# EAGLE design ArduinoStandaloneUsbSwitch-4Port (EAGLE 7.4.0)
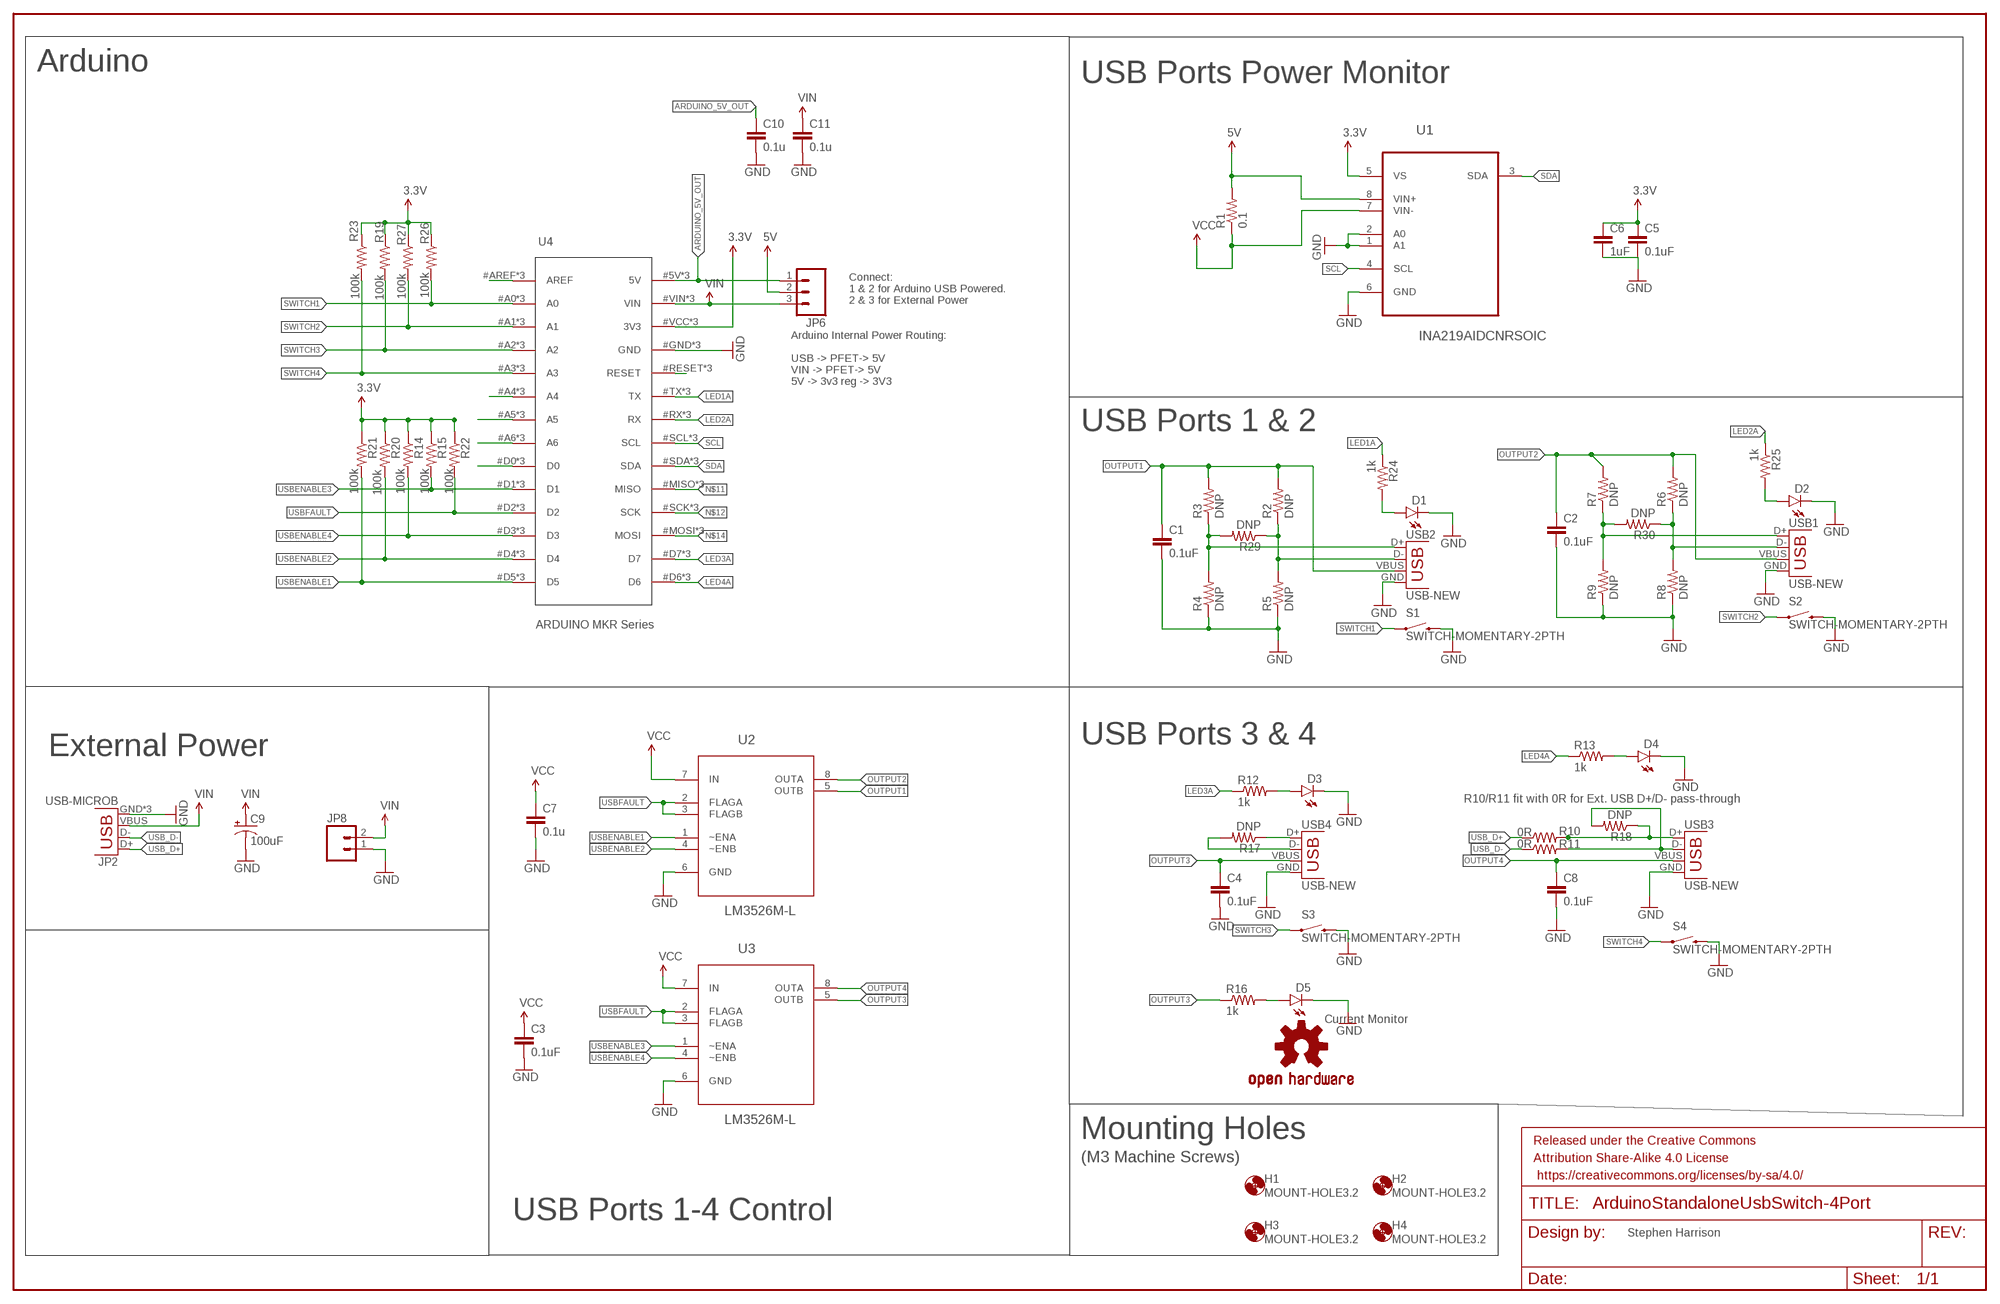
[diagram p0: schematic, sheet 1]

## Parts
C1  0.1uF  CAP0805  [0805]
C2  0.1uF  CAP0805  [0805]
C3  0.1uF  CAP0805  [0805]
C4  0.1uF  CAP0805  [0805]
C5  0.1uF  CAP0805  [0805]
C6  1uF  CAP0805  [0805]
C7  0.1u  CAP0805  [0805]
C8  0.1uF  CAP0805  [0805]
C9  100uF  100UF-10V-10%(TANT)  [EIA7343]
C10  0.1u  CAP0805  [0805]
C11  0.1u  CAP0805  [0805]
D1  LED3MM  [LED3MM]
D2  LED3MM  [LED3MM]
D3  LED3MM  [LED3MM]
D4  LED3MM  [LED3MM]
D5  LED1206-BOTTOM  [LED-1206-BOTTOM]
FRAME1  FRAME-LEDGER  [CREATIVE_COMMONS]
H1  MOUNT-HOLE3.2  [3,2]
H2  MOUNT-HOLE3.2  [3,2]
H3  MOUNT-HOLE3.2  [3,2]
H4  MOUNT-HOLE3.2  [3,2]
JP2  USB-MICROB  [USB-MICROB]
JP6  M03PTH  [1X03]
JP8  M025MM  [SCREWTERMINAL-5MM-2]
LOGO1  OSHW-LOGOL  [OSHW-LOGO-L]
R1  0.1  0.001OHM-3W-1%(2512)3W/1%  [2512]
R2  DNP  RESISTOR0805-RES  [0805]
R3  DNP  RESISTOR0805-RES  [0805]
R4  DNP  RESISTOR0805-RES  [0805]
R5  DNP  RESISTOR0805-RES  [0805]
R6  DNP  RESISTOR0805-RES  [0805]
R7  DNP  RESISTOR0805-RES  [0805]
R8  DNP  RESISTOR0805-RES  [0805]
R9  DNP  RESISTOR0805-RES  [0805]
R10  0R  RESISTOR0805-RES  [0805]
R11  0R  RESISTOR0805-RES  [0805]
R12  1k  RESISTOR0805-RES  [0805]
R13  1k  RESISTOR0805-RES  [0805]
R14  100k  RESISTOR0805-RES  [0805]
R15  100k  RESISTOR0805-RES  [0805]
R16  1k  RESISTOR0805-RES  [0805]
R17  DNP  RESISTOR0805-RES  [0805]
R18  DNP  RESISTOR0805-RES  [0805]
R19  100k  RESISTOR0805-RES  [0805]
R20  100k  RESISTOR0805-RES  [0805]
R21  100k  RESISTOR0805-RES  [0805]
R22  100k  RESISTOR0805-RES  [0805]
R23  100k  RESISTOR0805-RES  [0805]
R24  1k  RESISTOR0805-RES  [0805]
R25  1k  RESISTOR0805-RES  [0805]
R26  100k  RESISTOR0805-RES  [0805]
R27  100k  RESISTOR0805-RES  [0805]
R29  DNP  RESISTOR0805-RES  [0805]
R30  DNP  RESISTOR0805-RES  [0805]
S1  SWITCH-MOMENTARY-2PTH  [TACTILE-PTH]
S2  SWITCH-MOMENTARY-2PTH  [TACTILE-PTH]
S3  SWITCH-MOMENTARY-2PTH  [TACTILE-PTH]
S4  SWITCH-MOMENTARY-2PTH  [TACTILE-PTH]
U1  INA219AIDCNRSOIC  [SO08]
U2  LM3526M-L  [SOIC127P640X175-8N]
U3  LM3526M-L  [SOIC127P640X175-8N]
U4  ARDUINO MKR Series  ARDUINO_MKRFOX1200PROTOPADS  [ARDUINO_MKRFOX1200_PROTOPADS]
USB1  USB-NEW  [USB-A-VERTICAL]
USB2  USB-NEW  [USB-A-VERTICAL]
USB3  USB-NEW  [USB-A-VERTICAL]
USB4  USB-NEW  [USB-A-VERTICAL]

## Nets
3.3V: C5.1 C6.1 R14.1 R15.1 R19.1 R20.1 R21.1 R22.1 R23.1 R26.1 R27.1 U1.5(VS) U4.#VCC(3V3) U4.@VCC(3V3) U4.VCC(3V3)
5V: JP6.2 R1.2 U1.8(VIN+)
ARDUINO_5V_OUT: C10.1 JP6.1 U4.5V U4.#5V(5V) U4.@5V(5V)
GND: C1.2 C2.2 C3.2 C4.2 C5.2 C6.2 C7.2 C8.2 C9.C(-) C10.2 C11.2 D1.K(C) D2.K(C) D3.K(C) D4.K(C) D5.C JP2.GND JP2.MT1(GND) JP2.MT2(GND) JP8.1 R4.1 R5.1 R8.1 R9.1 S1.3 S2.3 S3.3 S4.3 U1.1(A1) U1.2(A0) U1.6(GND) U2.6(GND) U3.6(GND) U4.#GND(GND) U4.@GND(GND) U4.GND USB1.GND USB2.GND USB3.GND USB4.GND
LED1A: R24.1 U4.#TX(TX) U4.@TX(TX) U4.TX
LED2A: R25.1 U4.#RX(RX) U4.@RX(RX) U4.RX
LED3A: R12.1 U4.#D7(D7) U4.@D7(D7) U4.D7
LED4A: R13.1 U4.#D6(D6) U4.@D6(D6) U4.D6
N$1: R10.2 R18.1 USB3.D+
N$2: R11.2 R18.2 USB3.D-
N$4: D1.A R24.2
N$5: R17.1 USB4.D+
N$6: D2.A R25.2
N$7: U4.#RESET(RESET) U4.@RESET(RESET) U4.RESET
N$8: R17.2 USB4.D-
N$10: R3.1 R4.2 R29.2 USB2.D+
N$11: U4.#MISO(MISO) U4.@MISO(MISO) U4.MISO
N$12: U4.#SCK(SCK) U4.@SCK(SCK) U4.SCK
N$13: R2.1 R5.2 R29.1 USB2.D-
N$14: U4.#MOSI(MOSI) U4.@MOSI(MOSI) U4.MOSI
N$16: U4.#A4(A4) U4.@A4(A4) U4.A4
N$17: D3.A R12.2
N$18: R6.1 R8.2 R30.1 USB1.D-
N$19: D4.A R13.2
N$20: U4.#AREF(AREF) U4.@AREF(AREF) U4.AREF
N$21: U4.#D0(D0) U4.@D0(D0) U4.D0
N$22: D5.A R16.2
N$23: U4.#A6(A6) U4.@A6(A6) U4.A6
N$24: U4.#A5(A5) U4.@A5(A5) U4.A5
OUTPUT1: C1.1 R2.2 R3.2 U2.5(OUTB) USB2.VBUS
OUTPUT2: C2.1 R6.2 R7.2 U2.8(OUTA) USB1.VBUS
OUTPUT3: C4.1 R16.1 U3.5(OUTB) USB4.VBUS
OUTPUT4: C8.1 U3.8(OUTA) USB3.VBUS
SCL: U1.4(SCL) U4.#SCL(SCL) U4.@SCL(SCL) U4.SCL
SDA: U1.3(SDA) U4.#SDA(SDA) U4.@SDA(SDA) U4.SDA
SWITCH1: R26.2 S1.1 U4.#A0(A0) U4.@A0(A0) U4.A0
SWITCH2: R27.2 S2.1 U4.#A1(A1) U4.@A1(A1) U4.A1
SWITCH3: R19.2 S3.1 U4.#A2(A2) U4.@A2(A2) U4.A2
SWITCH4: R23.2 S4.1 U4.#A3(A3) U4.@A3(A3) U4.A3
USB2D-: R7.1 R9.2 R30.2 USB1.D+
USB_D+: JP2.D+ R10.1
USB_D-: JP2.D- R11.1
USBENABLE1: R21.2 U2.1(~ENA) U4.#D5(D5) U4.@D5(D5) U4.D5
USBENABLE2: R20.2 U2.4(~ENB) U4.#D4(D4) U4.@D4(D4) U4.D4
USBENABLE3: R15.2 U3.1(~ENA) U4.#D1(D1) U4.@D1(D1) U4.D1
USBENABLE4: R14.2 U3.4(~ENB) U4.#D3(D3) U4.@D3(D3) U4.D3
USBFAULT: R22.2 U2.2(FLAGA) U2.3(FLAGB) U3.2(FLAGA) U3.3(FLAGB) U4.#D2(D2) U4.@D2(D2) U4.D2
VCC: C3.1 C7.1 R1.1 U1.7(VIN-) U2.7(IN) U3.7(IN)
VIN: C9.A(+) C11.1 JP2.VBUS JP6.3 JP8.2 U4.#VIN(VIN) U4.@VIN(VIN) U4.VIN

## Notes on the sheet
- Arduino
- USB Ports Power Monitor
- Connect:
  1 & 2 for Arduino USB Powered.
  2 & 3 for External Power
- Arduino Internal Power Routing: 
  
  USB -> PFET-> 5V
  VIN -> PFET-> 5V
  5V -> 3v3 reg -> 3V3
- USB Ports 1 & 2
- USB Ports 3 & 4
- External Power
- R10/R11 fit with 0R for Ext. USB D+/D- pass-through
- Current Monitor
- Mounting Holes
- (M3 Machine Screws)
- USB Ports 1-4 Control
- Stephen Harrison

## Library data of the parts
C1-C8 C10 C11 = SparkFun-Capacitors:CAP: Capacitor Standard 0603 ceramic capacitor, and 0.1" leaded capacitor.
C9 = SparkFun-Capacitors:100UF-10V-10%(TANT): CAP-07890; PROD_ID: CAP-07890
D1 = SparkFun-LED:LED: LEDs Standard schematic elements and footprints for 5mm, 3mm, 1206, and 0603 sized LEDs. 5mm - Spark Fun Electronics SKU : COM-00529 (and others); FARNELL: 1208851
D2-D5 = SparkFun-LED:LED: LEDs Standard schematic elements and footprints for 5mm, 3mm, 1206, and 0603 sized LEDs. 5mm - Spark Fun Electronics SKU : COM-00529 (and others)
FRAME1 = SparkFun-Aesthetics:FRAME-LEDGER: Schematic Frame Standard 11x14 US Ledger frame
H1-H4 = holes:MOUNT-HOLE: MOUNTING HOLE with drill center marker
JP2 = SparkFun-Connectors:USB: USB Connectors USB-B-PTH is fully proven SKU : PRT-00139/CONN-08278 USB-miniB is fully proven SKU : PRT-00587 USB-A-PCB is untested. USB-A-H is throughly reviewed, but untested. Spark Fun Electronics SKU : PRT-00437 USB-B-SMT is throughly reviewed, but untested. Needs silkscreen touching up. USB-A-S has not been used/tested USB-MB-H has not been used/tested USB-MICROB has been used. CONN-09505; PROD_ID: CONN-09505
JP6 = SparkFun-Connectors:M03: Header 3 Standard 3-pin 0.1" header. Use with straight break away headers (SKU : PRT-00116), right angle break away headers (PRT-00553), swiss pins (PRT-00743), machine pins (PRT-00117), and female headers (PRT-00115). Molex polarized connector foot print use with SKU : PRT-08232 with associated crimp pins and housings.
JP8 = SparkFun-Connectors:M02: Standard 2-pin 0.1" header. Use with - straight break away headers ( PRT-00116) - right angle break away headers (PRT-00553) - swiss pins (PRT-00743) - machine pins (PRT-00117) - female headers (PRT-00115) Molex polarized connector foot print use with: PRT-08233 with associated crimp pins and housings. 2.54_SCREWTERM for use with PRT-10571. 3.5mm Screw Terminal footprints for PRT-08084 5mm Screw Terminal footprints for use with PRT-08432; STOREFRONT_ID: PRT-08432
LOGO1 = SparkFun-Aesthetics:OSHW-LOGO: Open Source Hardware Logo This logo indicates the piece of hardware it is found on incorporates a OSHW license and/or adheres to the definition of open source hardware found here: http://freedomdefined.org/OSHW
R1 = SparkFun-Resistors:0.001OHM-3W-1%(2512); FARNELL: 1435952; PROD_ID: RES-12449; VALUE: 0.001
R2-R27 R29 R30 = SparkFun-Resistors:RESISTOR: Resistor Basic schematic elements and footprints for 0603, 1206, and PTH resistors.
S1 = SparkFun-Electromechanical:SWITCH-MOMENTARY-2: Various NO switches- pushbuttons, reed, etc; FARNELL: 2533101; PROD_ID: SWCH-08441
S2-S4 = SparkFun-Electromechanical:SWITCH-MOMENTARY-2: Various NO switches- pushbuttons, reed, etc; PROD_ID: SWCH-08441
U1 = INA219AIDCNR:INA219AIDCNR: CURRENT/POWER MONITOR; FARNELL: 2496402
U2 U3 = LM3256M-L:LM3526M-L: Dual Port USB Power Switch; MPN: LM3526M-L; OC_FARNELL: 1469238; OC_NEWARK: 41K4868; PACKAGE: SOIC-8; SUPPLIER: National Semiconductor
U4 = Arduino:ARDUINO_MKRFOX1200
USB1 USB3 USB4 = Tinamous:USB-NEW: USB Connectors USB-B-PTH is fully proven SKU : PRT-00139/CONN-08278 USB-miniB is fully proven SKU : PRT-00587 USB-A-PCB is untested. USB-A-H is throughly reviewed, but untested. Spark Fun Electronics SKU : PRT-00437 USB-B-SMT is throughly reviewed, but untested. Needs silkscreen touching up. USB-A-S has not been used/tested USB-MB-H has not been used/tested USB-MICROB has been used. CONN-09505
USB2 = Tinamous:USB-NEW: USB Connectors USB-B-PTH is fully proven SKU : PRT-00139/CONN-08278 USB-miniB is fully proven SKU : PRT-00587 USB-A-PCB is untested. USB-A-H is throughly reviewed, but untested. Spark Fun Electronics SKU : PRT-00437 USB-B-SMT is throughly reviewed, but untested. Needs silkscreen touching up. USB-A-S has not been used/tested USB-MB-H has not been used/tested USB-MICROB has been used. CONN-09505; FARNELL: 1177882

## Board
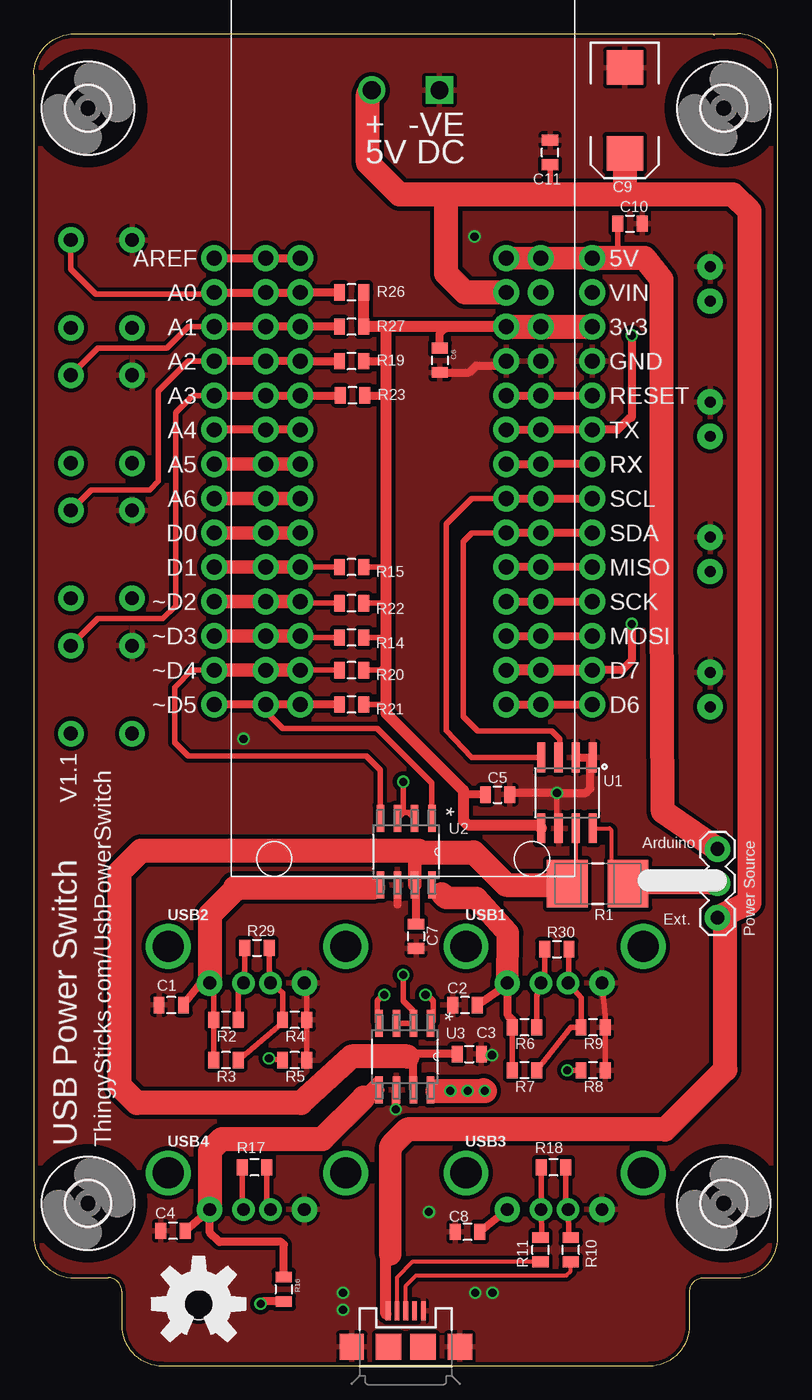
[diagram p1: board, top side]
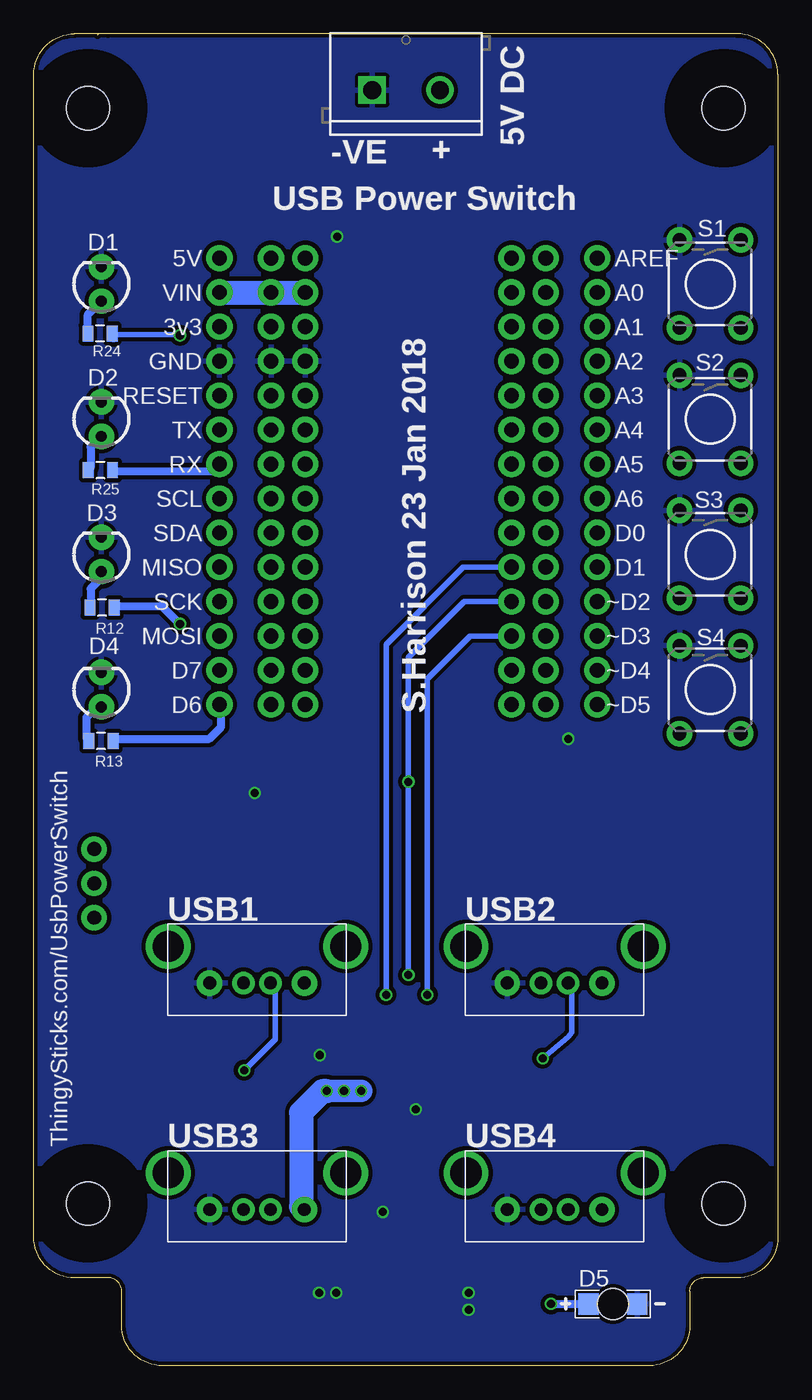
[diagram p2: board, bottom side, seen from below]

Size 55 x 98.5 mm. Coordinates in mm from the lower left corner, seen from the top.
Outline: 49.5,98.5 52,98.5 arc-90 55,95.5 55,9.5 arc-90 52,6.5 49.5,6.5 arc90 48.5,5.5 48.5,3 arc-90 45.5,0 9.5,0 arc-90 6.5,3 6.5,5.5 arc90 5.5,6.5 3,6.5 arc-90 0,9.5 0,95.5 arc-90 3,98.5 50.2,98.5 50.3,98.4
Copper layers (1*16): Top 0.035mm / dielectric 1.5mm / Bottom 0.035mm
Design rules "dirt_cheap_dirty_boards.v1": minimum track width 5mil, minimum drill 12mil, track to track 5mil, track to pad 5mil, pad to pad 5mil, via to via 5mil, smd to smd 0mil, copper to edge 10mil, drill to drill 10mil, minimum pad ring 10mil, minimum via ring 6mil, stop-mask expansion 2mil, vias tented up to drill 25mil, thermal gap 10mil

### Footprints (pad centres in the part's own frame; a part is rotated, then mirrored left to right if it is on the bottom)
0805 = smd 0.8 x 1.2: 1 -0.9,0; 2 0.9,0
EIA7343 = smd 2.55 x 2.7: A 3.17,0; C -3.17,0
LED3MM = drill 0.813 pad 1.88: A -1.27,0; K 1.27,0
LED-1206-BOTTOM = smd 1.5 x 1.6: A -1.8,0; C 1.8,0 | hole 2.3: 0,0
3,2 = hole 3.2: 0,0
USB-MICROB = smd 0.35 x 1.4: D+ 0,2.65; D- -0.65,2.65; GND 1.3,2.65; ID 0.65,2.65; VBUS -1.3,2.65 | smd 1.8 x 1.9: MT1 -4,0; MT2 4,0 | smd 1.9 x 1.9: P$1 -1.27,0; P$2 1.27,0
1X03 = drill 1.016 pad 1.88: 1 0,0; 2 2.54,0; 3 5.08,0
SCREWTERMINAL-5MM-2 = drill 1.3 pad 2.032 square: 1 0,0 | drill 1.3 pad 2.032: 2 5,0
2512 = smd 3 x 3.5: 1 -2.25,0; 2 2.25,0
TACTILE-PTH = drill 1.016 pad 1.88: 1 -3.251,2.261; 2 3.251,2.261; 3 -3.251,-2.261; 4 3.251,-2.261
SO08 = smd 0.61 x 2.21: 1 -1.905,-2.616; 2 -0.635,-2.616; 3 0.635,-2.616; 4 1.905,-2.616; 5 1.905,2.616; 6 0.635,2.616; 7 -0.635,2.616; 8 -1.905,2.616
SOIC127P640X175-8N = smd 1.981 x 0.559: 1 -2.464,1.905; 2 -2.464,0.635; 3 -2.464,-0.635; 4 -2.464,-1.905; 5 2.464,-1.905; 6 2.464,-0.635; 7 2.464,0.635; 8 2.464,1.905
ARDUINO_MKRFOX1200_PROTOPADS = drill 1.1 pad 1.93: 5V 22.86,45.72; #5V 20.32,45.72; #A0 5.08,43.18; #A1 5.08,40.64; #A2 5.08,38.1; #A3 5.08,35.56; #A4 5.08,33.02; #A5 5.08,30.48; #A6 5.08,27.94; #AREF 5.08,45.72; #D0 5.08,25.4; #D1 5.08,22.86; #D2 5.08,20.32; #D3 5.08,17.78; #D4 5.08,15.24; #D5 5.08,12.7; #D6 20.32,12.7; #D7 20.32,15.24; #GND 20.32,38.1; #MISO 20.32,22.86; #MOSI 20.32,17.78; #RESET 20.32,35.56; #RX 20.32,30.48; #SCK 20.32,20.32; #SCL 20.32,27.94; #SDA 20.32,25.4; #TX 20.32,33.02; #VCC 20.32,40.64; #VIN 20.32,43.18; @5V 26.67,45.72; @A0 -1.27,43.18; @A1 -1.27,40.64; @A2 -1.27,38.1; @A3 -1.27,35.56; @A4 -1.27,33.02; @A5 -1.27,30.48; @A6 -1.27,27.94; @AREF -1.27,45.72; @D0 -1.27,25.4; @D1 -1.27,22.86; @D2 -1.27,20.32; @D3 -1.27,17.78; @D4 -1.27,15.24; @D5 -1.27,12.7; @D6 26.67,12.7; @D7 26.67,15.24; @GND 26.67,38.1; @MISO 26.67,22.86; @MOSI 26.67,17.78; @RESET 26.67,35.56; @RX 26.67,30.48; @SCK 26.67,20.32; @SCL 26.67,27.94; @SDA 26.67,25.4; @TX 26.67,33.02; @VCC 26.67,40.64; @VIN 26.67,43.18; A0 2.54,43.18; A1 2.54,40.64; A2 2.54,38.1; A3 2.54,35.56; A4 2.54,33.02; A5 2.54,30.48; A6 2.54,27.94; AREF 2.54,45.72; D0 2.54,25.4; D1 2.54,22.86; D2 2.54,20.32; D3 2.54,17.78; D4 2.54,15.24; D5 2.54,12.7; D6 22.86,12.7; D7 22.86,15.24; GND 22.86,38.1; MISO 22.86,22.86; MOSI 22.86,17.78; RESET 22.86,35.56; RX 22.86,30.48; SCK 22.86,20.32; SCL 22.86,27.94; SDA 22.86,25.4; TX 22.86,33.02; VCC 22.86,40.64; VIN 22.86,43.18
USB-A-VERTICAL = drill 0.95 pad 1.676: D+ 2.7,1; D- 2.7,-1 | drill 0.95 pad 1.88: GND 2.7,3.5; VBUS 2.7,-3.5 | drill 2.3: SHLD1 0,-6.55; SHLD2 0,6.55

### Placement (x,y rotation side)
C1  10.16,26.67 180 top
C2  31.88,26.67 180 top
C3  32.19,23.05 0 top
C4  10.29,9.97 180 top
C5  34.29,42.23 0 top
C6  30.02,74.36 270 top
C7  28.26,31.75 270 top
C8  32.07,9.91 180 top
C9  43.69,92.84 270 top
C10  44.07,84.45 0 top
C11  38.16,89.73 90 top
D1  50,80 90 bottom
D2  50,70 90 bottom
D3  50,60 90 bottom
D4  50,50 90 bottom
D5  12.19,4.57 0 bottom
FRAME1  -1.27,-10.16 0 top  (outside the outline)
H1  51,12 0 top
H2  4,12 0 top
H3  51,93 0 top
H4  4,93 0 top
JP2  27.5,1.4 0 top
JP6  50.54,38.21 270 top
JP8  29.98,94.33 0 bottom
LOGO1  12.19,4.57 0 top
R1  41.68,35.64 0 top
R2  14.21,25.57 180 top
R3  14.21,22.59 180 top
R4  19.29,25.57 180 top
R5  19.29,22.59 180 top
R6  36.27,25.02 180 top
R7  36.27,21.85 180 top
R8  41.35,21.85 180 top
R9  41.35,25.02 180 top
R10  39.69,8.57 90 top
R11  37.47,8.57 90 top
R12  49.95,56.07 180 bottom
R13  50.03,46.21 180 bottom
R14  23.5,53.85 180 top
R15  23.5,59.05 180 top
R16  18.48,5.65 270 top
R17  16.32,14.67 180 top
R18  38.42,14.67 180 top
R19  23.5,74.3 180 top
R20  23.5,51.44 180 top
R21  23.5,48.9 180 top
R22  23.5,56.39 180 top
R23  23.56,71.75 180 top
R24  50.09,76.33 180 bottom
R25  50.08,66.23 180 bottom
R26  23.5,79.38 180 top
R27  23.5,76.83 180 top
R29  16.5,30.91 0 top
R30  38.66,30.8 0 top
S1  5,80 270 bottom
S2  5,70 270 bottom
S3  5,60 270 bottom
S4  5,50 270 bottom
U1  39.42,42.37 180 top
U2  27.52,38.01 270 top
U3  27.43,22.86 270 top
U4  14.61,36.2 0 top
USB1  38.5,31 270 top
USB2  16.5,31 270 top
USB3  38.5,14.25 270 top
USB4  16.5,14.25 270 top

### Tracks (layer width: path | path; a pad name or v marks a point on that pad's centre or on a via)
3.3V
  Top 0.406: R15.1 26.04,59.05 26.04,59.44 | 26.04,56.52 26.04,56.39 R22.1 | R21.1 25.91,48.9 26.04,48.77 | R20.1 25.65,51.44 26.04,51.82 | R14.1 25.53,53.85 26.04,53.34
  Top 0.61: C6.1 30.02,76.37 30.48,76.83 | C5.1 32.07,42.23 31.75,42.55 | R19.1 26.04,74.3 | R23.1 25.91,71.75 26.04,71.63
  Top 0.813: U4.#VCC 30.48,76.83 26.04,76.83 | 26.04,76.83 26.04,74.3 26.04,71.63 26.04,59.44 26.04,56.39 26.04,53.34 26.04,51.82 26.04,48.77 26.04,48.26 31.75,42.55 31.75,40.32 32.07,40.01 37.26,40.01 U1.5 | 26.04,76.83 R27.1 R26.1
  Top 1.778: U4.#VCC U4.VCC U4.@VCC
5V
  Top 0.305: U1.8 42.55,39.75 42.67,39.62 42.67,36.32 43.12,35.88
  Top 0.406: 43.12,35.88 43.12,35.51 R1.2 | 44.2,35.75 44.21,35.74
  Top 1.778: JP6.2 49.4,35.74 44.21,35.74 | 44.2,35.75 R1.2
ARDUINO_5V_OUT
  Top 0.406: C10.1 43.17,82.41 42.67,81.92
  Top 1.676: U4.#5V U4.5V U4.@5V
  Top 1.778: JP6.1 46.5,40.98 46.42,56.52 46.42,80.33 45.15,81.92 42.67,81.92 U4.@5V
GND  (via drill 0.6)
  Top 0.305: 23.7,1.61 23.7,1.7 23.5,1.91 23.5,1.27
  Top 0.406: R5.1 R4.1 20.19,28.27 USB2.GND | R8.1 R9.1 42.25,25.54 42.23,25.9 USB1.GND | U1.6 38.67,39.86 v38.67,42.36 v38.66,42.37 | 40.1,44.94 U1.2 | 41.4,44.91 U1.1 41.34,44.91
  Top 0.61: U1.2 U1.1 41.15,44.8 41.15,42.67 40.85,42.37 v38.66,42.37 35.33,42.37 C5.2 | U2.6 26.89,34.08 | v26.76,18.97 26.76,20.36 U3.6 | C3.2 33.34,23.05 33.53,22.86 33.76,22.86 v33.87,22.97 | C6.2 32.18,73.46 32.7,73.98 34.61,73.98 U4.#GND
  Top 1.016: JP2.MT1 23.7,1.61 23.55,1.76 | 31.8,1.76 31.8,1.5 JP2.MT2
  other vias: 32.64,5.4 22.86,5.4 22.86,4.13 33.91,5.4 15.5,46.36 29.21,11.37 32.58,83.51
  pour Bottom (isolate 0.305, rank 6): -0.37,105.77 55.18,105.63 55.38,-0.34 -0.37,-0.44
  pour Top (isolate 0.305): -1.65,0 -1.65,100.84 55.63,100.84 55.63,0
LED1A  (via drill 0.6)
  Top 0.61: U4.#TX U4.TX U4.@TX 43.18,69.22 44.07,70.1 44.2,70.1 v44.2,76.2
  Bottom 0.406: 49.12,76.26 44.26,76.26 v44.2,76.2
  Bottom 0.61: 49.1,75.97 R24.1 49.12,76.26
LED2A
  Top 0.61: U4.#RX U4.RX U4.@RX
  Bottom 0.61: U4.@RX 41.78,66.17 49.12,66.17 R25.1
LED3A  (via drill 0.6)
  Top 0.61: v44.2,54.86 44.2,52.13 43.5,51.44 U4.@D7
  Top 0.813: U4.@D7 U4.D7 U4.#D7
  Bottom 0.61: v44.2,54.86 45.53,56.2 48.92,56.2 R12.1
LED4A
  Top 0.61: U4.#D6 U4.D6 U4.@D6
  Bottom 0.61: U4.@D6 41.15,48.77 41.15,47.24 42.04,46.35 48.98,46.35 R13.1
N$1
  Top 0.406: R10.2 39.54,9.62 USB3.D+ 39.32,11.73 R18.1
N$2
  Top 0.406: R11.2 37.54,9.55 USB3.D- 37.52,11.57 R18.2
N$4
  Bottom 0.61: R24.2 50.99,77.73 D1.A
N$5
  Top 0.406: R17.1 17.22,11.83 USB4.D+
N$6
  Bottom 0.61: D2.A 50.02,68.73 50.8,67.94 50.8,66.42 R25.2
N$7
  Top 0.61: U4.#RESET U4.RESET U4.@RESET
N$8
  Top 0.406: R17.2 15.42,11.63 USB4.D-
N$10
  Top 0.406: R3.1 18.28,25.27 R4.2 18.39,27.56 USB2.D+ 17.4,28.4 R29.2
N$11
  Top 0.61: U4.@MISO U4.MISO U4.#MISO
N$12
  Top 0.61: U4.#SCK U4.SCK U4.@SCK
N$13  (via drill 0.6)
  Top 0.406: R5.2 v17.38,22.73 | R2.1 15.11,27.88 USB2.D- 15.6,28.4 R29.1
  Bottom 0.406: v17.38,22.73 15.5,24.32 15.24,24.64 15.24,27.76 USB2.D-
N$14
  Top 0.61: U4.#MOSI U4.MOSI U4.@MOSI
N$16
  Top 0.61: U4.#A4 U4.A4 U4.@A4
N$17
  Bottom 0.61: D3.A 50,58.27 50.8,57.47 50.8,56.12 R12.2
N$18  (via drill 0.6)
  Top 0.406: R8.2 v39.45,21.85 | R6.1 37.17,27.36 USB1.D- 37.77,28.57 R30.1
  Bottom 0.406: v39.45,21.85 39.43,21.85 37.15,24.13 37.15,27.66 USB1.D-
N$19
  Bottom 0.61: D4.A 50.33,48.73 51.12,47.94 51.12,46.4 R13.2
N$20
  Top 0.61: U4.@AREF U4.AREF U4.#AREF
N$21
  Top 1.016: U4.#D0 U4.D0 U4.@D0
N$22  (via drill 0.6)
  Top 0.61: R16.2 16.94,4.75 v16.76,4.57
  Bottom 0.61: v16.76,4.57 D5.A
N$23
  Top 1.016: U4.@A6 U4.A6 U4.#A6
N$24
  Top 1.016: U4.#A5 U4.A5 U4.@A5
OUTPUT1
  Top 0.406: R3.2 R2.2 13.31,28.14 USB2.VBUS
  Top 0.61: 25.08,35.37 25.43,35.37 U2.5 | C1.1 12.32,28.26 13.02,28.96
  Top 1.778: 25.08,35.37 14.86,35.37 14.86,35.18 13.02,33.34 13.02,28.96 13.02,28.32 USB2.VBUS
OUTPUT2
  Top 0.406: R7.2 R6.2
  Top 0.61: 30.16,34.92 30.05,34.92 U2.8 | C2.1 34.64,27.94 | 34.64,27.94 USB1.VBUS | R6.2 35.37,25.59 35.05,25.91 35.05,27.53 34.64,27.94
  Top 1.676: USB1.VBUS 35.05,32 32.7,34.61 30.48,34.61 30.16,34.92
OUTPUT3
  Top 0.61: C4.1 12.94,11.49 USB4.VBUS 13.02,11.53 13.02,9.84 13.72,9.14 18.29,9.14 18.48,8.95 R16.1
  Top 0.813: 24.38,19.81 24.38,19.94 25.4,20.95 25.4,20.52 U3.5
  Top 1.778: 24.38,19.81 21.34,16.76 13.91,16.76 13.02,15.88 13.02,11.57 USB4.VBUS
OUTPUT4  (via drill 0.6)
  Top 0.61: U3.8 29.77,20.4 29.84,20.32 | C8.1 34.94,11.49 USB3.VBUS
  Top 1.778: 33.26,20.4 v33.34,20.32 v32.07,20.32 v30.8,20.32 29.84,20.32
  Bottom 1.676: v33.34,20.32 v32.07,20.32 v30.8,20.32
  Bottom 1.778: v33.34,20.32 33.66,20.32 35.24,18.73 35.24,11.79 USB3.VBUS
SCL
  Top 0.406: U1.4 32.39,44.98 30.48,46.99 30.48,62.23 32.38,64.14 U4.#SCL
  Top 0.61: U4.#SCL U4.SCL U4.@SCL
SDA
  Top 0.406: U1.3 38.89,46.36 38.3,46.95 32.83,46.95 31.75,48.02 31.75,60.96 32.38,61.59 U4.#SDA
  Top 0.61: U4.@SDA U4.SDA U4.#SDA
SWITCH1
  Top 0.406: S1.1 2.74,81.08 4.57,79.25 13.21,79.25 U4.@A0
  Top 0.61: U4.@A0 U4.A0 U4.#A0 R26.2
SWITCH2
  Top 0.406: U4.@A1 11.43,76.83 9.84,75.25 4.74,75.25 S2.1
  Top 0.61: U4.@A1 U4.A1 U4.#A1 R27.2
SWITCH3
  Top 0.406: U4.@A2 11.43,74.3 9.21,72.07 9.21,65.41 8.57,64.77 4.26,64.77 S3.1
  Top 0.61: U4.@A2 U4.A2 U4.#A2 R19.2
SWITCH4
  Top 0.406: U4.@A3 11.75,71.75 10.48,70.48 10.48,56.2 9.53,55.24 4.73,55.24 S4.1
  Top 0.61: U4.@A3 U4.A3 U4.#A3 R23.2
USB2D-
  Top 0.406: R7.1 39.71,25.02 R9.2 40.47,25.34 40.47,27.18 USB1.D+ 39.56,28.36 R30.2
USB_D+
  Top 0.305: JP2.D+ 27.5,5.91 28.26,6.67 39.37,6.67 39.69,6.99 R10.1
USB_D-
  Top 0.305: R11.1 27.99,7.67 26.84,6.51 26.84,4.33 26.82,4.34 JP2.D-
USBENABLE1
  Top 0.406: U2.1 29.43,43.09 25.4,47.12 18.41,47.12 17.14,48.39 U4.D5
  Top 0.61: U4.@D5 U4.D5 U4.#D5 R21.2
USBENABLE2
  Top 0.406: U2.4 25.61,44.04 24.57,45.09 11.43,45.09 10.41,46.1 10.41,50.16 11.68,51.44 U4.@D4 | R20.2 U4.#D4
  Top 1.016: U4.@D4 U4.D4 U4.#D4
USBENABLE3  (via drill 0.6)
  Top 0.406: v28.96,27.43 29.08,27.43 29.53,26.99 29.53,25.51 U3.1 | R15.2 U4.#D1
  Top 1.016: U4.@D1 U4.D1 U4.#D1
  Bottom 0.406: U4.#D1 23.24,59.05 28.96,53.34 v28.96,27.43
USBENABLE4  (via drill 0.6)
  Top 0.406: v25.91,27.43 25.84,27.43 25.4,26.99 25.4,25.45 U3.4 | R14.2 19.81,53.85 U4.#D3
  Top 1.016: U4.@D3 U4.D3 U4.#D3
  Bottom 0.406: v25.91,27.43 25.91,50.8 22.73,53.98 U4.#D3
USBFAULT  (via drill 0.6)
  Top 0.406: U3.3 U3.2 28.07,26.23 27.3,26.99 v27.3,28.89 | v27.3,43.18 27.3,40.9 | 27.3,40.9 U2.3 | 27.3,40.9 27.73,40.9 U2.2 | R22.2 19.81,56.39 U4.#D2
  Top 1.016: U4.#D2 U4.D2 U4.@D2
  Bottom 0.406: v27.3,28.89 v27.3,43.18 27.3,52.39 23.18,56.52 U4.#D2
VCC
  Top 0.305: 28.2,35.5 U2.7 | U1.7 40.06,36.27 R1.1
  Top 0.61: U3.7 28.07,22.42 27.78,22.7 | 27.78,22.7 27.62,22.86 | C3.1 28.13,23.05 27.78,22.7 | C7.1 28.26,35.45 U2.7
  Top 1.016: U2.7 28.16,37.55 28.57,37.97
  Top 1.676: 28.25,37.97 28.57,37.97
  Top 1.778: 27.62,22.86 23.5,22.86 19.75,19.43 7.62,19.43 6.35,20.7 6.35,36.51 7.94,38.1 28.44,38.1 28.57,37.97 32.51,37.97 34.92,35.56 39.35,35.56 R1.1
VIN
  Top 0.406: 26.04,3.81 26.16,3.81 JP2.VBUS | C11.1 38.16,86.68 38.1,86.61
  Top 0.813: 26.04,3.81 26.04,7.94 26.35,8.26
  Top 1.676: 26.35,8.26 26.35,16.19 26.48,16.32
  Top 1.778: 26.48,16.32 27.62,17.46 46.67,17.46 51.12,21.91 51.12,33.07 JP6.3 52.9,34.24 52.9,85.41 51.69,86.61 44.2,86.61 | 44.2,86.61 38.1,86.61 30.48,86.61 | 30.48,86.61 27.05,86.61 24.7,88.96 24.7,94.05 JP8.2 24.96,94.18 | U4.#VIN 31.88,79.38 30.48,80.77 30.48,86.61 | C9.A 43.69,87.12 44.2,86.61
  Bottom 1.778: U4.@VIN U4.VIN U4.#VIN

### Text on the board
tNames: + | -VE | 5V DC | V1.1 | Arduino | Ext. | Power Source | USB Power Switch | ThingySticks.com/UsbPowerSwitch
bNames: 5V DC | + | -VE | USB Power Switch | S.Harrison 23 Jan 2018 | ThingySticks.com/UsbPowerSwitch